# EAGLE design solar (EAGLE 8.2.2)
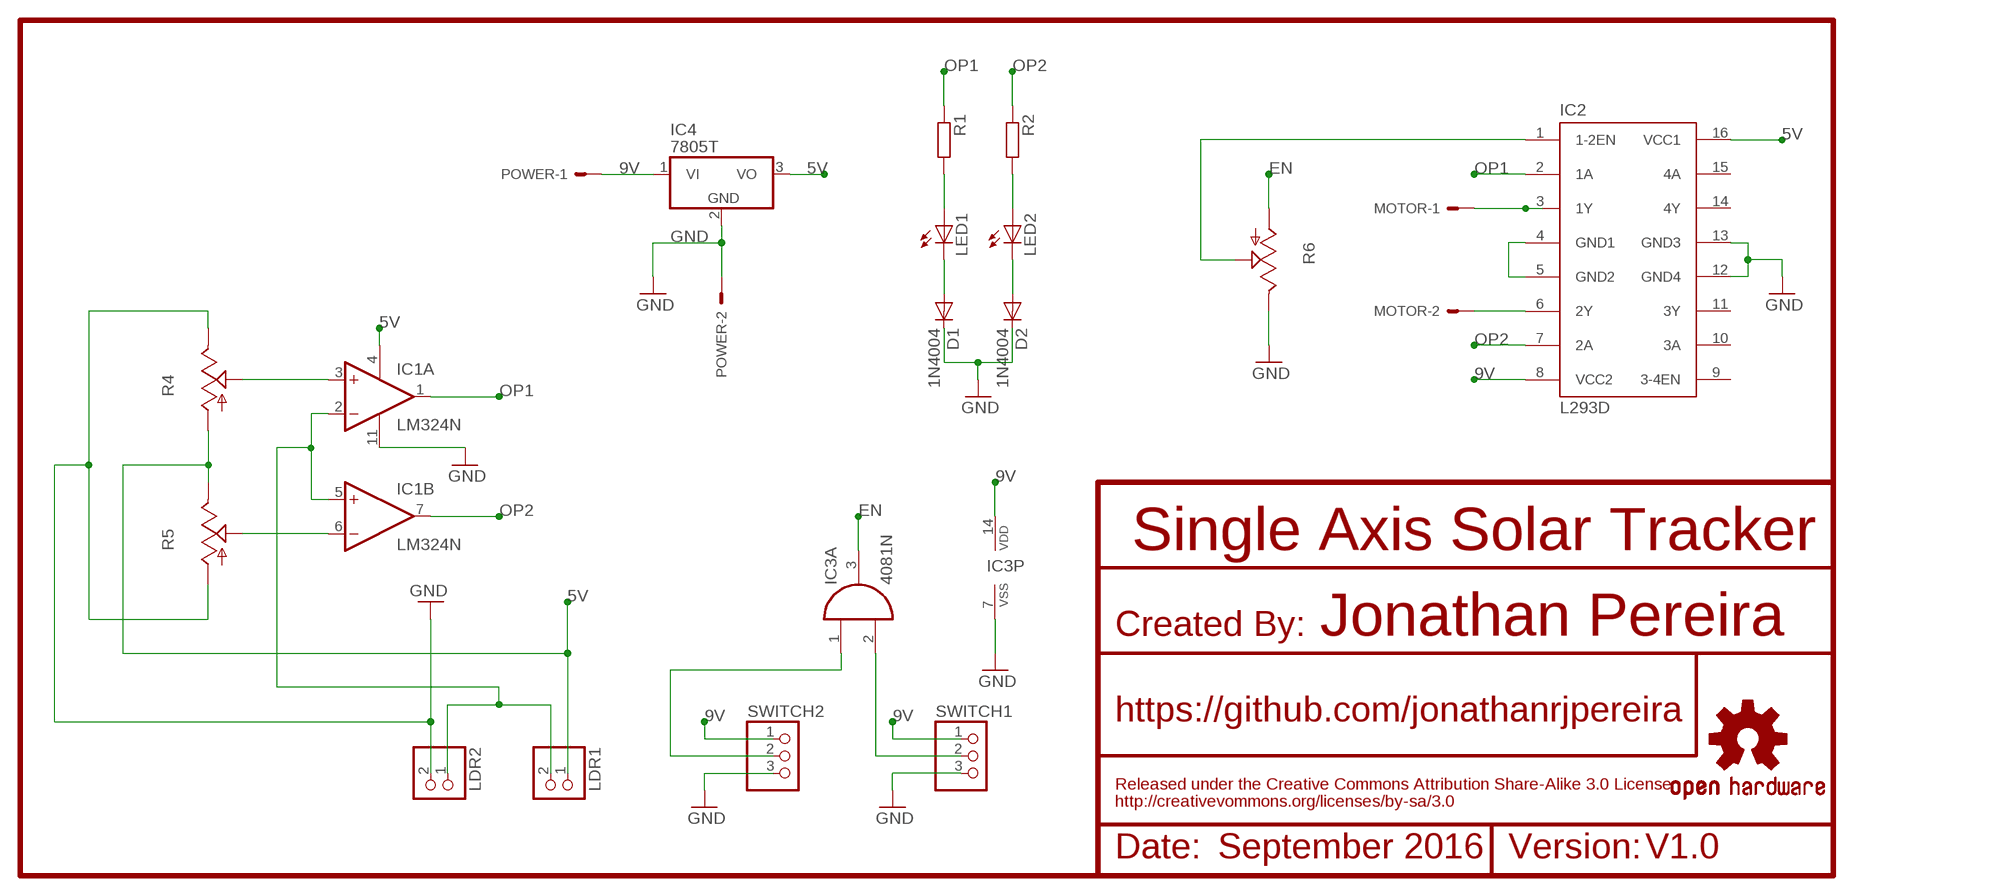
[diagram p0: schematic, sheet 1]

## Parts
D1  1N4004  [DO41-10]
D2  1N4004  [DO41-10]
IC1  LM324N  [DIL14]
IC2  L293D  [DIL16]
IC3  4081N  [DIL14]
IC4  7805T  [TO220H]
LDR1  PINHD-1X2  [1X02]
LDR2  PINHD-1X2  [1X02]
LED1  LED5MM  [LED5MM]
LED2  LED5MM  [LED5MM]
LOGO1  OSHW-LOGOL-COPPER  [OSHW-LOGO-L_COPPER]
MOTOR  KK-156-2  [KK-156-2]
POWER  KK-156-2  [KK-156-2]
R1  R-EU_0204/7  [0204/7]
R2  R-EU_0204/7  [0204/7]
R4  TRIM_US-CA6V  [CA6V]
R5  TRIM_US-CA6V  [CA6V]
R6  TRIM_US-CA6V  [CA6V]
SWITCH1  PINHD-1X3  [1X03]
SWITCH2  PINHD-1X3  [1X03]

## Nets
5V: IC1.4(P:V+) IC2.16(VCC1) IC4.3(VO) LDR1.1 R4.A R5.E
9V: IC2.8(VCC2) IC3.14(P:VDD) IC4.1(VI) POWER.1 SWITCH1.1 SWITCH2.1
EN: IC3.3(A:O) R6.A
GND: D1.C D2.C IC1.11(P:V-) IC2.12(GND4) IC2.13(GND3) IC3.7(P:VSS) IC4.2(GND) LDR2.2 POWER.2 R4.E R5.A R6.E SWITCH1.3 SWITCH2.3
N$1: IC2.3(1Y) MOTOR.1
N$2: IC2.6(2Y) MOTOR.2
N$3: IC2.4(GND1) IC2.5(GND2)
N$4: IC2.1(1-2EN) R6.S
N$5: IC3.1(A:I0) SWITCH2.2
N$6: IC3.2(A:I1) SWITCH1.2
N$7: IC1.2(A:-IN) IC1.5(B:+IN) LDR1.2 LDR2.1
N$8: IC1.3(A:+IN) R4.S
N$9: IC1.6(B:-IN) R5.S
N$12: LED1.A R1.2
N$13: LED2.A R2.2
N$14: D2.A LED2.K(C)
N$15: D1.A LED1.K(C)
OP1: IC1.1(A:OUT) IC2.2(1A) R1.1
OP2: IC1.7(B:OUT) IC2.7(2A) R2.1
Unconnected: IC1.8(C:OUT) IC1.9(C:-IN) IC1.10(C:+IN) IC1.12(D:+IN) IC1.13(D:-IN) IC1.14(D:OUT) IC2.9(3-4EN) IC2.10(3A) IC2.11(3Y) IC2.14(4Y) IC2.15(4A) IC3.4(B:O) IC3.5(B:I0) IC3.6(B:I1) IC3.8(C:I0) IC3.9(C:I1) IC3.10(C:O) IC3.11(D:O) IC3.12(D:I0) IC3.13(D:I1)

## Notes on the sheet
- Single Axis Solar Tracker
- Created By: | Jonathan Pereira
- https://github.com/jonathanrjpereira
- Released under the Creative Commons Attribution Share-Alike 3.0 License
- http://creativevommons.org/licenses/by-sa/3.0
- Date: | September 2016 | Version: | V1.0

## Library data of the parts
D1 D2 = adafruit:1N4004: DIODE General purpose 1N400x type rectifier (With bigger pads) http://www.ladyada.net/library/pcb/eaglelibrary.html
IC1 = linear:LM324: OP AMP
IC2 = st-microelectronics:L293D: PUSH-PULL 4 CHANNEL DRIVER; MPN: L293D; OC_FARNELL: 9589619; OC_NEWARK: 56P8249
IC3 = 40xx:4081: Quad 2-input AND
IC4 = adafruit:78*: Positive VOLTAGE REGULATOR Added bigger pads to the TO-92 package
LDR1 LDR2 = pinhead:PINHD-1X2: PIN HEADER
LED1 LED2 = adafruit:LED: LED OSRAM: - CHIPLED LG R971, LG N971, LY N971, LG Q971, LY Q971, LO R971, LY R971 LH N974, LH R974 LS Q976, LO Q976, LY Q976 LO Q996 - Hyper CHIPLED LW Q18S LB Q993, LB Q99A, LB R99A - SideLED LS A670, LO A670, LY A670, LG A670, LP A670 LB A673, LV A673, LT A673, LW A673 LH A674 LY A675 LS A676, LA A676, LO A676, LY A676, LW A676 LS A679, LY A679, LG A679 - Hyper Micro SIDELED® LS Y876, LA Y876, LO Y876, LY Y876 LT Y87S - SmartLED LW L88C, LW L88S LB L89C, LB L89S, LG L890 LS L89K, LO L89K, LY L89K LS L896, LA L896, LO L896, LY L896 - TOPLED LS T670, LO T670, LY T670, LG T670, LP T670 LSG T670, LSP T670, LSY T670, LOP T670, LYG T670 LG T671, LOG T671, LSG T671 LB T673, LV T673, LT T673, LW T673 LH T674 LS T676, LA T676, LO T676, LY T676, LB T676, LH T676, LSB T676, LW T676 LB T67C, LV T67C, LT T67C, LS T67K, LO T67K, LY T67K, LW E67C LS E67B, LA E67B, LO E67B, LY E67B, LB E67C, LV E67C, LT E67C LW T67C LS T679, LY T679, LG T679 LS T770, LO T770, LY T770, LG T770, LP T770 LB T773, LV T773, LT T773, LW T773 LH T774 LS E675, LA E675, LY E675, LS T675 LS T776, LA T776, LO T776, LY T776, LB T776 LHGB T686 LT T68C, LB T68C - Hyper Mini TOPLED® LB M676 - Mini TOPLED Santana® LG M470 LS M47K, LO M47K, LY M47K Source: http://www.osram.convergy.de/
LOGO1 = SparkFun-Aesthetics:OSHW-LOGO: Open-Source Hardware (OSHW) Logo This logo indicates the piece of hardware it is found on incorporates a OSHW license and/or adheres to the definition of open source hardware found here: http://freedomdefined.org/OSHW
MOTOR POWER = con-molex:KK-156-2: KK 156 HEADER Source: http://www.molex.com/pdm_docs/sd/026604100_sd.pdf; OC_FARNELL: unknown; OC_NEWARK: unknown
R1 R2 = resistor:R-EU_: RESISTOR, European symbol
R4-R6 = pot:TRIM_US-: POTENTIOMETER
SWITCH1 SWITCH2 = pinhead:PINHD-1X3: PIN HEADER

## Board
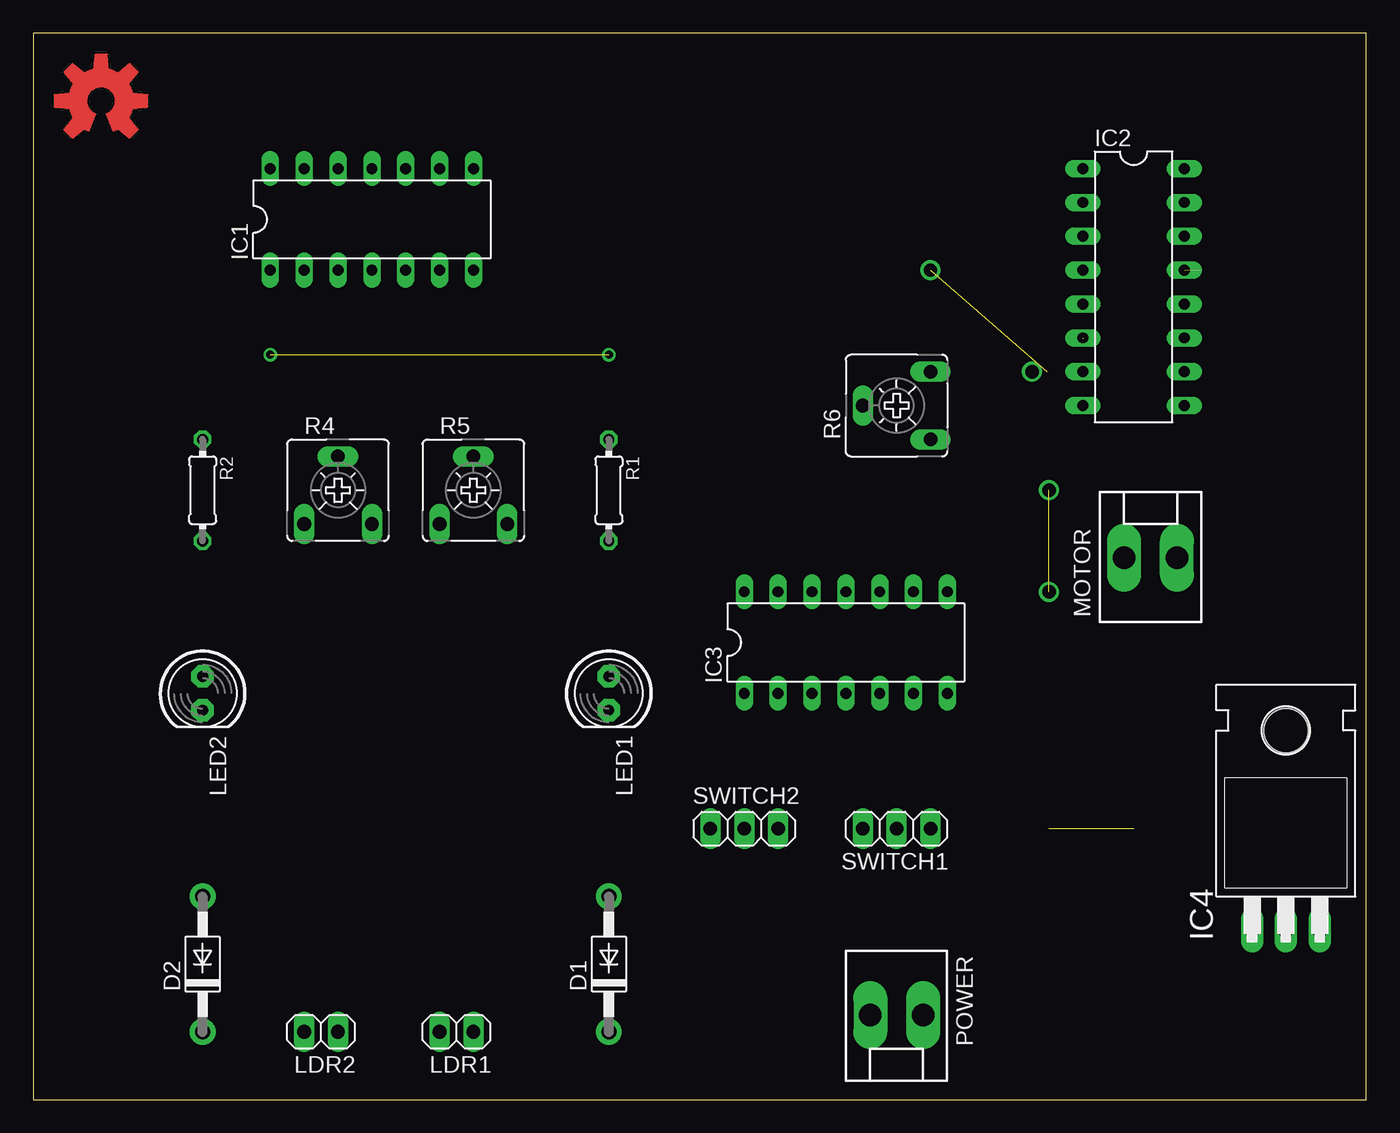
[diagram p1: board, top side]
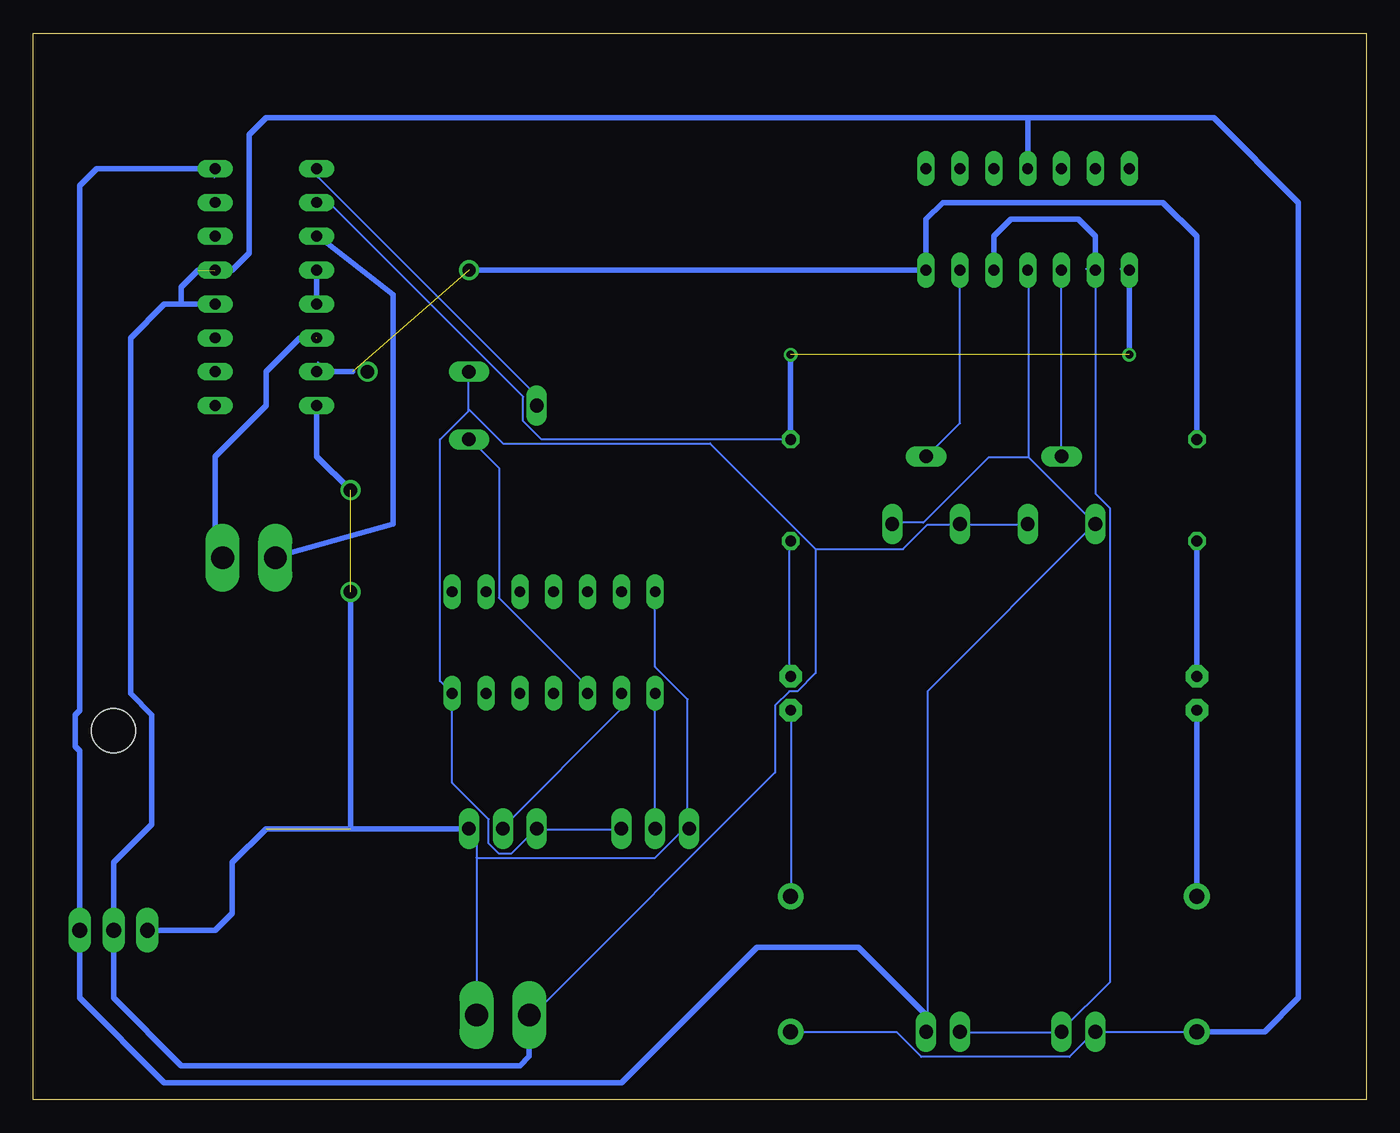
[diagram p2: board, bottom side, seen from below]

Size 100 x 80 mm. Coordinates in mm from the lower left corner, seen from the top.
Outline: 0,0 100,0 100,80 0,80 0,0
Copper layers (1*16): Top 0.035mm / dielectric 1.5mm / Bottom 0.035mm
Design rules "default": minimum track width 6mil, minimum drill 0.35mm, track to track 6mil, track to pad 6mil, pad to pad 6mil, via to via 6mil, smd to smd 6mil, copper to edge 40mil, drill to drill 6mil, minimum pad ring 10mil, minimum via ring 8mil, stop-mask expansion 4mil, vias tented up to drill 0mil, thermal gap 10mil

### Footprints (pad centres in the part's own frame; a part is rotated, then mirrored left to right if it is on the bottom)
DO41-10 = drill 1.118 pad 1.93: A 5.08,0; C -5.08,0
DIL14 = drill 0.813 long: 1 -7.62,-3.81; 2 -5.08,-3.81; 3 -2.54,-3.81; 4 0,-3.81; 5 2.54,-3.81; 6 5.08,-3.81; 7 7.62,-3.81; 8 7.62,3.81; 9 5.08,3.81; 10 2.54,3.81; 11 0,3.81; 12 -2.54,3.81; 13 -5.08,3.81; 14 -7.62,3.81
DIL16 = drill 0.813 long: 1 -8.89,-3.81; 2 -6.35,-3.81; 3 -3.81,-3.81; 4 -1.27,-3.81; 5 1.27,-3.81; 6 3.81,-3.81; 7 6.35,-3.81; 8 8.89,-3.81; 9 8.89,3.81; 10 6.35,3.81; 11 3.81,3.81; 12 1.27,3.81; 13 -1.27,3.81; 14 -3.81,3.81; 15 -6.35,3.81; 16 -8.89,3.81
TO220H = drill 1.118 long: 1 -2.54,-10.16; 2 0,-10.16; 3 2.54,-10.16 | hole 3.302: 0,4.826
1X02 = drill 1.016 long: 1 -1.27,0; 2 1.27,0
LED5MM = drill 0.813 pad 1.676 octagon: A -1.27,0; K 1.27,0
KK-156-2 = drill 1.7 pad 2.184 long: 1 -1.98,0; 2 1.98,0
0204/7 = drill 0.813 octagon: 1 -3.81,0; 2 3.81,0
CA6V = drill 1.016 long: A -2.54,-2.54; E 2.54,-2.54; S 0,2.54
1X03 = drill 1.016 long: 1 -2.54,0; 2 0,0; 3 2.54,0

### Placement (x,y rotation side)
D1  43.18,10.16 90 top
D2  12.7,10.16 90 top
IC1  25.4,66.04 0 top
IC2  82.55,60.96 270 top
IC3  60.96,34.29 0 top
IC4  93.98,22.86 0 top
LDR1  31.75,5.08 180 top
LDR2  21.59,5.08 180 top
LED1  43.18,30.48 270 top
LED2  12.7,30.48 270 top
LOGO1  5.08,74.93 0 top
MOTOR  83.82,40.64 0 top
POWER  64.77,6.35 180 top
R1  43.18,45.72 270 top
R2  12.7,45.72 270 top
R4  22.86,45.72 0 top
R5  33.02,45.72 0 top
R6  64.77,52.07 90 top
SWITCH1  64.77,20.32 180 top
SWITCH2  53.34,20.32 0 top

### Tracks (layer width: path | path; a pad name or v marks a point on that pad's centre or on a via)
5V
  Bottom 0.152: 86.41,69.19 86.41,69.72 86.41,69.8 IC2.16 | 96.77,12.95 IC4.3 | 25.3,48.16 25.3,62.18 IC1.4 | 25.3,48.16 R4.A 20.42,43.13 32.92,30.63 32.92,6.4 | 32.92,6.4 32.92,5.18 LDR1.1 32.92,6.4 | 25.3,48.16 28.35,48.16 33.22,43.28 35.51,43.28 R5.E
  Bottom 0.406: IC4.3 96.52,26.17 96.85,26.5 96.85,28.88 96.52,29.2 96.52,68.58 95.25,69.85 86.54,69.85 86.41,69.72 | LDR1.1 33.02,6.35 38.1,11.43 45.72,11.43 55.88,1.27 90.17,1.27 96.52,7.62 IC4.3 | IC4.3 96.77,12.95
9V  (via drill 1 pad 0.85)  (2 unrouted)
  Bottom 0.152: IC3.14 53.34,32.46 50.9,30.02 50.9,20.42 SWITCH2.1 50.9,20.27 51.21,20.27 53.34,18.14 66.75,18.14 | 78.79,51.97 IC2.8 | 67.36,20.42 SWITCH1.1 67.21,20.27 66.75,19.81 66.75,18.14 | 91.4,12.85 91.44,12.8 IC4.1 | 66.75,18.14 66.75,6.4 POWER.1
  Bottom 0.406: IC2.8 78.74,48.26 v76.2,45.72 | 91.4,12.85 91.25,12.7 86.36,12.7 85.09,13.97 85.09,17.78 82.55,20.32 SWITCH1.1 | 76.2,20.32 v76.2,38.1
EN
  Bottom 0.152: IC3.3 58.52,30.48 58.52,31.09 65.08,37.64 65.08,47.4 67.21,49.53 R6.A
GND  (1 unrouted)
  Bottom 0.152: 93.88,12.65 IC4.2 93.88,12.8 | 62.94,6.25 POWER.2 62.79,6.4 62.48,6.4 44.35,24.54 44.35,29.57 43.28,30.63 42.67,30.63 41.3,32 41.3,41.3 | 30.48,43.13 25.45,43.13 R4.E | SWITCH2.3 55.93,20.27 62.18,20.27 SWITCH1.3 62.33,20.27 64.16,18.44 65.08,18.44 65.84,19.2 65.84,21.03 68.58,23.77 IC3.7 69.49,31.39 69.49,49.53 67.36,51.66 67.36,51.82 | 67.36,51.82 67.36,54.56 R6.E | 30.48,43.13 32.92,43.13 34.75,41.3 41.3,41.3 | 41.3,41.3 49.23,49.23 64.77,49.23 67.36,51.82 | 30.48,43.13 R5.A | D1.C 43.13,5.03 35.2,5.03 33.38,3.2 22.25,3.2 20.42,5.03 LDR2.2 20.27,5.03 12.8,5.03 D2.C 12.65,5.18 | 86.41,59.74 IC2.12 86.39,59.64 86.41,59.59 | 86.41,62.18 IC2.13 | 25.45,69.95 IC1.11 25.35,69.82 25.3,69.8
  Bottom 0.406: D2.C 7.62,5.08 5.08,7.62 5.08,67.31 11.43,73.66 25.4,73.66 | 25.4,73.66 25.4,69.88 25.35,69.82 | 25.4,73.66 82.55,73.66 83.82,72.39 83.82,63.5 85.09,62.23 87.63,62.23 88.9,60.96 88.9,59.69 86.44,59.69 86.39,59.64 | IC2.12 90.17,59.69 92.71,57.15 92.71,30.48 91.11,28.88 91.11,20.65 93.98,17.78 IC4.2 93.98,7.62 88.9,2.54 63.5,2.54 62.79,3.25 POWER.2
N$1
  Bottom 0.152: 78.64,64.77 IC2.3 | 81.84,40.69 MOTOR.1
  Bottom 0.406: 78.64,64.77 73,60.4 73,43.18 81.84,40.69
N$2  (1 unrouted)
  Bottom 0.152: 78.79,56.54 78.79,57.15 | MOTOR.2 85.65,40.69
  Bottom 0.406: IC2.6 80.01,57.15 82.55,54.61 82.55,52.07 86.36,48.26 86.36,41.2 MOTOR.2
N$3
  Bottom 0.406: IC2.4 IC2.5
N$4
  Bottom 0.152: IC2.1 78.64,69.8 78.64,69.19 62.33,52.88 62.33,52.12 R6.S
N$5
  Bottom 0.152: SWITCH2.2 IC3.1
N$6
  Bottom 0.152: IC3.2 55.93,30.48 55.93,29.26 64.77,20.42 SWITCH1.2
N$7
  Bottom 0.152: 21.03,62.33 20.42,62.33 IC1.2 20.27,62.18 20.27,45.41 19.2,44.35 19.2,8.84 22.86,5.18 LDR2.1 22.86,5.03 30.48,5.03 LDR1.2 | 27.89,62.33 IC1.5
  Bottom 0.406: IC1.2 20.32,64.77 21.59,66.04 26.67,66.04 27.94,64.77 IC1.5
N$8
  Bottom 0.152: R4.S IC1.3
N$9
  Bottom 0.152: IC1.6 30.48,50.75 32.92,48.31 R5.S
N$10  (via drill 1 pad 0.85)
  other vias: 74.93,54.61
N$12
  Bottom 0.152: R1.2 43.28,41.91 43.28,31.85 LED1.A
N$13
  Bottom 0.152: 12.8,41.91 R2.2 | 12.8,31.85 LED2.A
  Bottom 0.406: LED2.A 12.7,41.81 12.8,41.91
N$14
  Bottom 0.152: 12.65,29.11 LED2.K | 12.65,15.24 D2.A
  Bottom 0.406: D2.A 12.7,29.06 12.65,29.11
N$15
  Bottom 0.152: LED1.K 43.13,29.11 43.13,15.24 D1.A
OP1  (via drill 0.6 pad 0.85)  (1 unrouted)
  Bottom 0.152: 18.44,62.33 17.83,62.33 IC1.1 | 43.13,49.53 R1.1 61.87,49.53 63.25,50.9 63.25,52.73 77.72,67.21 78.64,67.21 IC2.2
  Bottom 0.406: IC1.1 v17.78,55.88 | R1.1 v43.18,55.88
OP2  (via drill 1 pad 0.85)  (1 unrouted)
  Bottom 0.152: 12.8,49.53 R2.1 | 78.64,55.32 78.64,54.71 IC2.7 | 33.07,62.33 IC1.7
  Bottom 0.406: R2.1 12.7,64.77 15.24,67.31 31.75,67.31 33.02,66.04 IC1.7 v67.31,62.23 | IC2.7 76.04,54.61